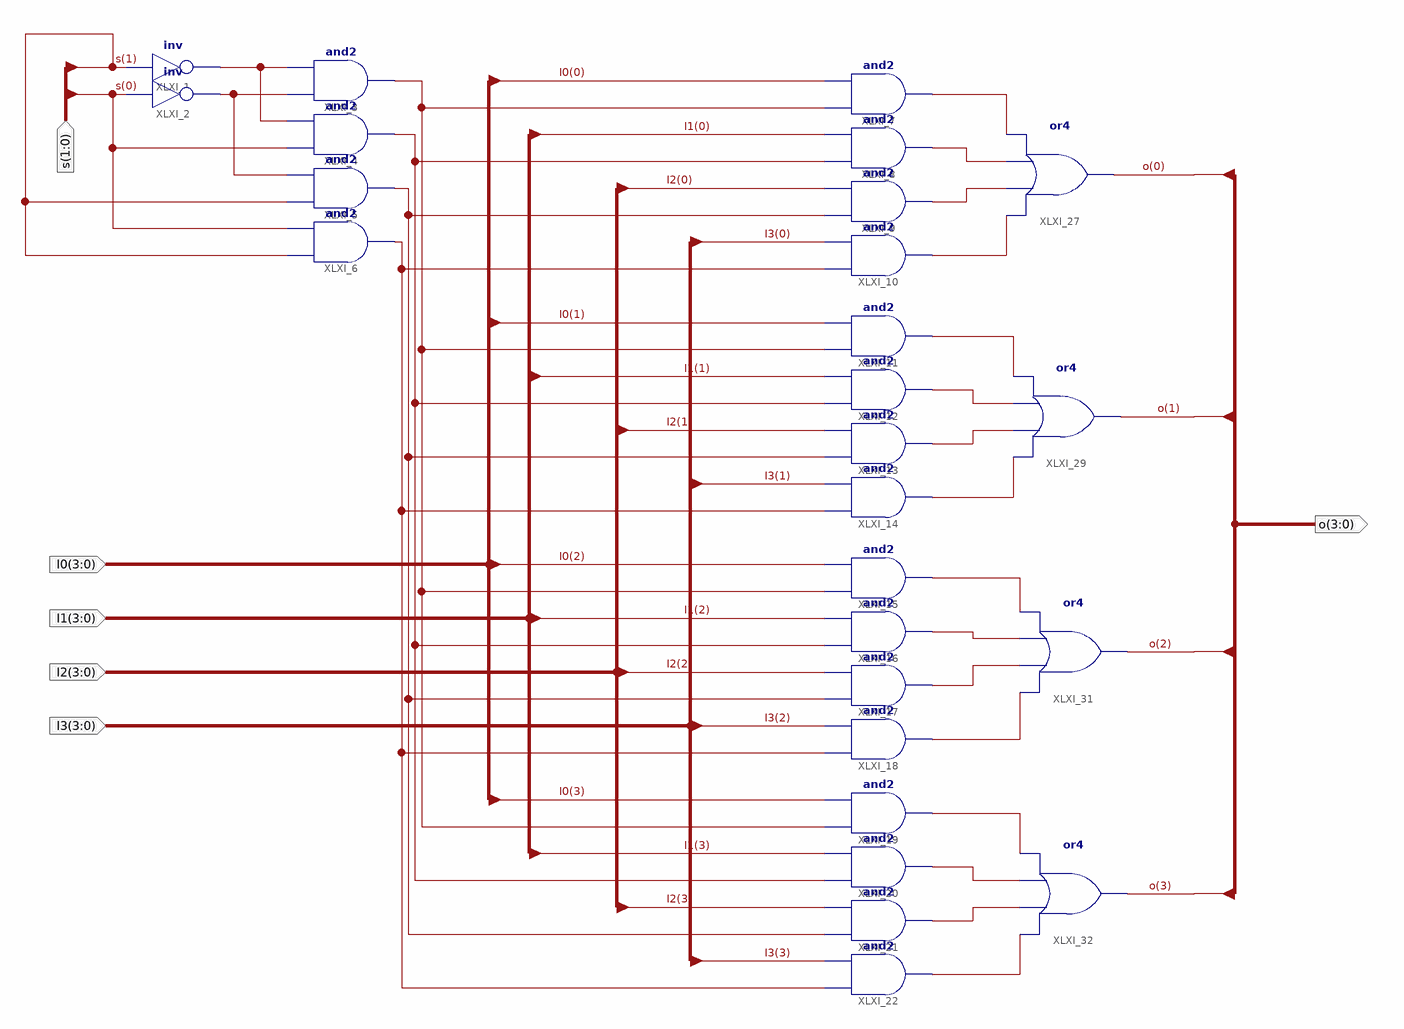
[diagram p0: schematic sheet 1]
// Xilinx ISE schematic Mux4to1b4.sch (kintex7) as structural Verilog: 26 symbols, 6 ports
module Mux4to1b4 (
  input  [1:0] s,
  input  [3:0] I0,
  input  [3:0] I2,
  input  [3:0] I3,
  input  [3:0] I1,
  output [3:0] o
);

  wire XLXN_2, XLXN_3, XLXN_5, XLXN_6, XLXN_7, XLXN_8, XLXN_67, XLXN_68, XLXN_70, XLXN_71, XLXN_72, XLXN_73,
       XLXN_74, XLXN_75, XLXN_76, XLXN_77, XLXN_78, XLXN_79, XLXN_80, XLXN_81, XLXN_82, XLXN_83;

  not XLXI_1 (XLXN_2, s[1]);
  not XLXI_2 (XLXN_3, s[0]);
  and XLXI_3 (XLXN_7, XLXN_3, XLXN_2);
  and XLXI_4 (XLXN_6, s[0], XLXN_2);
  and XLXI_5 (XLXN_8, s[1], XLXN_3);
  and XLXI_6 (XLXN_5, s[1], s[0]);
  and XLXI_7 (XLXN_67, XLXN_7, I0[0]);
  and XLXI_8 (XLXN_68, XLXN_6, I1[0]);
  and XLXI_9 (XLXN_70, XLXN_8, I2[0]);
  and XLXI_10 (XLXN_71, XLXN_5, I3[0]);
  and XLXI_11 (XLXN_72, XLXN_7, I0[1]);
  and XLXI_12 (XLXN_73, XLXN_6, I1[1]);
  and XLXI_13 (XLXN_74, XLXN_8, I2[1]);
  and XLXI_14 (XLXN_75, XLXN_5, I3[1]);
  and XLXI_15 (XLXN_76, XLXN_7, I0[2]);
  and XLXI_16 (XLXN_77, XLXN_6, I1[2]);
  and XLXI_17 (XLXN_78, XLXN_8, I2[2]);
  and XLXI_18 (XLXN_79, XLXN_5, I3[2]);
  and XLXI_19 (XLXN_80, XLXN_7, I0[3]);
  and XLXI_20 (XLXN_81, XLXN_6, I1[3]);
  and XLXI_21 (XLXN_82, XLXN_8, I2[3]);
  and XLXI_22 (XLXN_83, XLXN_5, I3[3]);
  or XLXI_27 (o[0], XLXN_71, XLXN_70, XLXN_68, XLXN_67);
  or XLXI_29 (o[1], XLXN_75, XLXN_74, XLXN_73, XLXN_72);
  or XLXI_31 (o[2], XLXN_79, XLXN_78, XLXN_77, XLXN_76);
  or XLXI_32 (o[3], XLXN_83, XLXN_82, XLXN_81, XLXN_80);
endmodule
